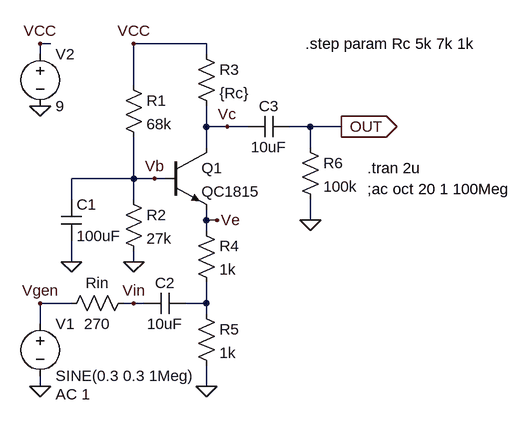
[diagram p0: schematic BaseCommon.asc]
BaseCommon.asc, the LTspice schematic file:
Version 4
SHEET 1 988 680
WIRE 16 -64 0 -64
WIRE 256 -64 144 -64
WIRE 0 -48 0 -64
WIRE 256 -48 256 -64
WIRE 144 0 144 -64
WIRE 256 64 256 32
WIRE 288 64 256 64
WIRE 320 64 288 64
WIRE 416 64 384 64
WIRE 464 64 416 64
WIRE 256 96 256 64
WIRE 416 96 416 64
WIRE 144 144 144 80
WIRE 144 144 48 144
WIRE 176 144 144 144
WIRE 192 144 176 144
WIRE 48 176 48 144
WIRE 144 176 144 144
WIRE 256 208 256 192
WIRE 272 208 256 208
WIRE 416 208 416 176
WIRE 256 224 256 208
WIRE 48 272 48 240
WIRE 144 272 144 256
WIRE 48 336 0 336
WIRE 144 336 128 336
WIRE 160 336 144 336
WIRE 256 336 256 304
WIRE 256 336 224 336
WIRE 256 352 256 336
WIRE 0 368 0 336
WIRE 0 464 0 448
WIRE 256 464 256 432
FLAG 144 272 0
FLAG 48 272 0
FLAG 256 464 0
FLAG 0 464 0
FLAG 0 336 Vgen
FLAG 464 64 OUT
IOPIN 464 64 Out
FLAG 0 32 0
FLAG 0 -64 VCC
FLAG 144 -64 VCC
FLAG 176 144 Vb
FLAG 144 336 Vin
FLAG 272 208 Ve
FLAG 288 64 Vc
FLAG 416 208 0
SYMBOL npn 192 96 R0
SYMATTR InstName Q1
SYMATTR Value QC1815
SYMBOL res 128 -16 R0
SYMATTR InstName R1
SYMATTR Value 68k
SYMBOL res 128 160 R0
SYMATTR InstName R2
SYMATTR Value 27k
SYMBOL cap 32 176 R0
SYMATTR InstName C1
SYMATTR Value 100uF
SYMBOL res 240 -64 R0
SYMATTR InstName R3
SYMATTR Value {Rc}
SYMBOL res 240 208 R0
SYMATTR InstName R4
SYMATTR Value 1k
SYMBOL res 240 336 R0
SYMATTR InstName R5
SYMATTR Value 1k
SYMBOL cap 224 320 R90
WINDOW 0 0 32 VBottom 2
WINDOW 3 32 32 VTop 2
SYMATTR InstName C2
SYMATTR Value 10uF
SYMBOL voltage 0 352 R0
WINDOW 123 24 124 Left 2
WINDOW 39 24 152 Left 2
SYMATTR Value2 AC 1
SYMATTR InstName V1
SYMATTR Value SINE(0.3 0.3 1Meg)
SYMBOL voltage 0 -64 R0
SYMATTR InstName V2
SYMATTR Value 9
SYMBOL cap 384 48 R90
WINDOW 0 0 32 VBottom 2
WINDOW 3 32 32 VTop 2
SYMATTR InstName C3
SYMATTR Value 10uF
SYMBOL res 144 320 R90
WINDOW 0 0 56 VBottom 2
WINDOW 3 32 56 VTop 2
SYMATTR InstName Rin
SYMATTR Value 270
SYMBOL res 400 80 R0
SYMATTR InstName R6
SYMATTR Value 100k
TEXT 504 128 Left 2 !.tran 2u
TEXT 504 160 Left 2 !;ac oct 20 1 100Meg
TEXT 408 -64 Left 2 !.step param Rc 5k 7k 1k

The netlist it stands for:
* BaseCommon.asc
Q1 Vc Vb Ve 0 QC1815
R1 VCC Vb 68k
R2 Vb 0 27k
C1 Vb 0 100uF
R3 VCC Vc {Rc}
R4 Ve N001 1k
R5 N001 0 1k
C2 N001 Vin 10uF
V1 Vgen 0 SINE(0.3 0.3 1Meg) AC 1
V2 VCC 0 9
C3 OUT Vc 10uF
Rin Vin Vgen 270
R6 OUT 0 100k
.model NPN NPN
.model PNP PNP
.lib standard.bjt
.tran 2u
;ac oct 20 1 100Meg
.step param Rc 5k 7k 1k
.backanno
.end